# Altium project CoreBoard.PrjPcb
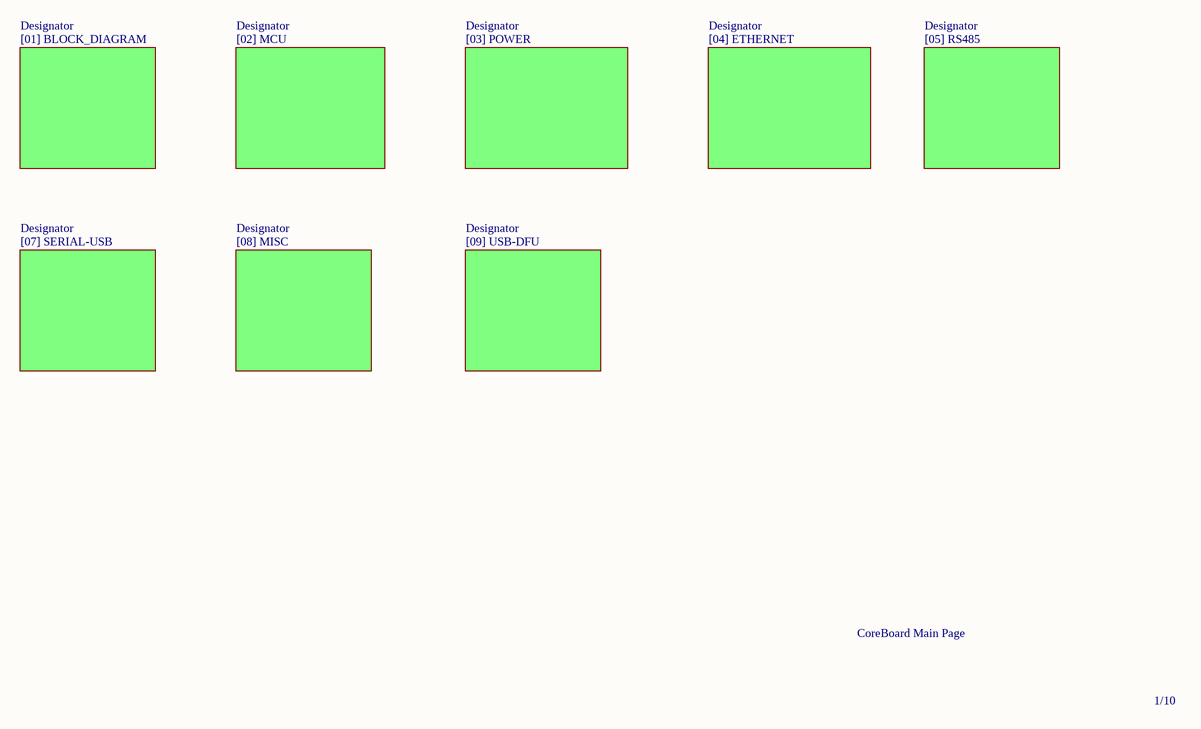
[diagram p0: CoreBoard.SchDoc]
9 sheets, 113 parts. Net scope: flat (ports and power ports of the same name join across sheets).
Board file: PCB.PcbDoc
Sheets:
  CoreBoard.SchDoc
    Designator = [01] BLOCK_DIAGRAM.SchDoc
    Designator = [02] MCU.SchDoc
    Designator = [03] POWER.SchDoc
    Designator = [04] ETHERNET.SchDoc
    Designator = [05] RS485.SchDoc
    Designator = [07] SERIAL-USB.SchDoc
    Designator = [08] MISC.SchDoc
    Designator = [09] USB-DFU.SchDoc

## Sheet CoreBoard.SchDoc: Core Board Simulador E5A/B1
size A4; Date: 01/07/12024; ApprovedBy: Laert Ferreira; Author: Deived Ado/Jonhann Steff.; CompanyName: Metro Rio; Engineer: Jonhann Steffanno; Organization: SENAI; Revision: REV01; SheetNumber: 1; SheetTotal: 10

### Sub-sheets
Designator = [01] BLOCK_DIAGRAM: no entries
Designator = [02] MCU: no entries
Designator = [03] POWER: no entries
Designator = [04] ETHERNET: no entries
Designator = [05] RS485: no entries
Designator = [07] SERIAL-USB: no entries
Designator = [08] MISC: no entries
Designator = [09] USB-DFU: no entries

### Notes on the sheet
- CoreBoard Main Page
- 1/10

## Sheet [01] BLOCK_DIAGRAM.SchDoc
size A4; SheetNumber: 2; SheetTotal: 10
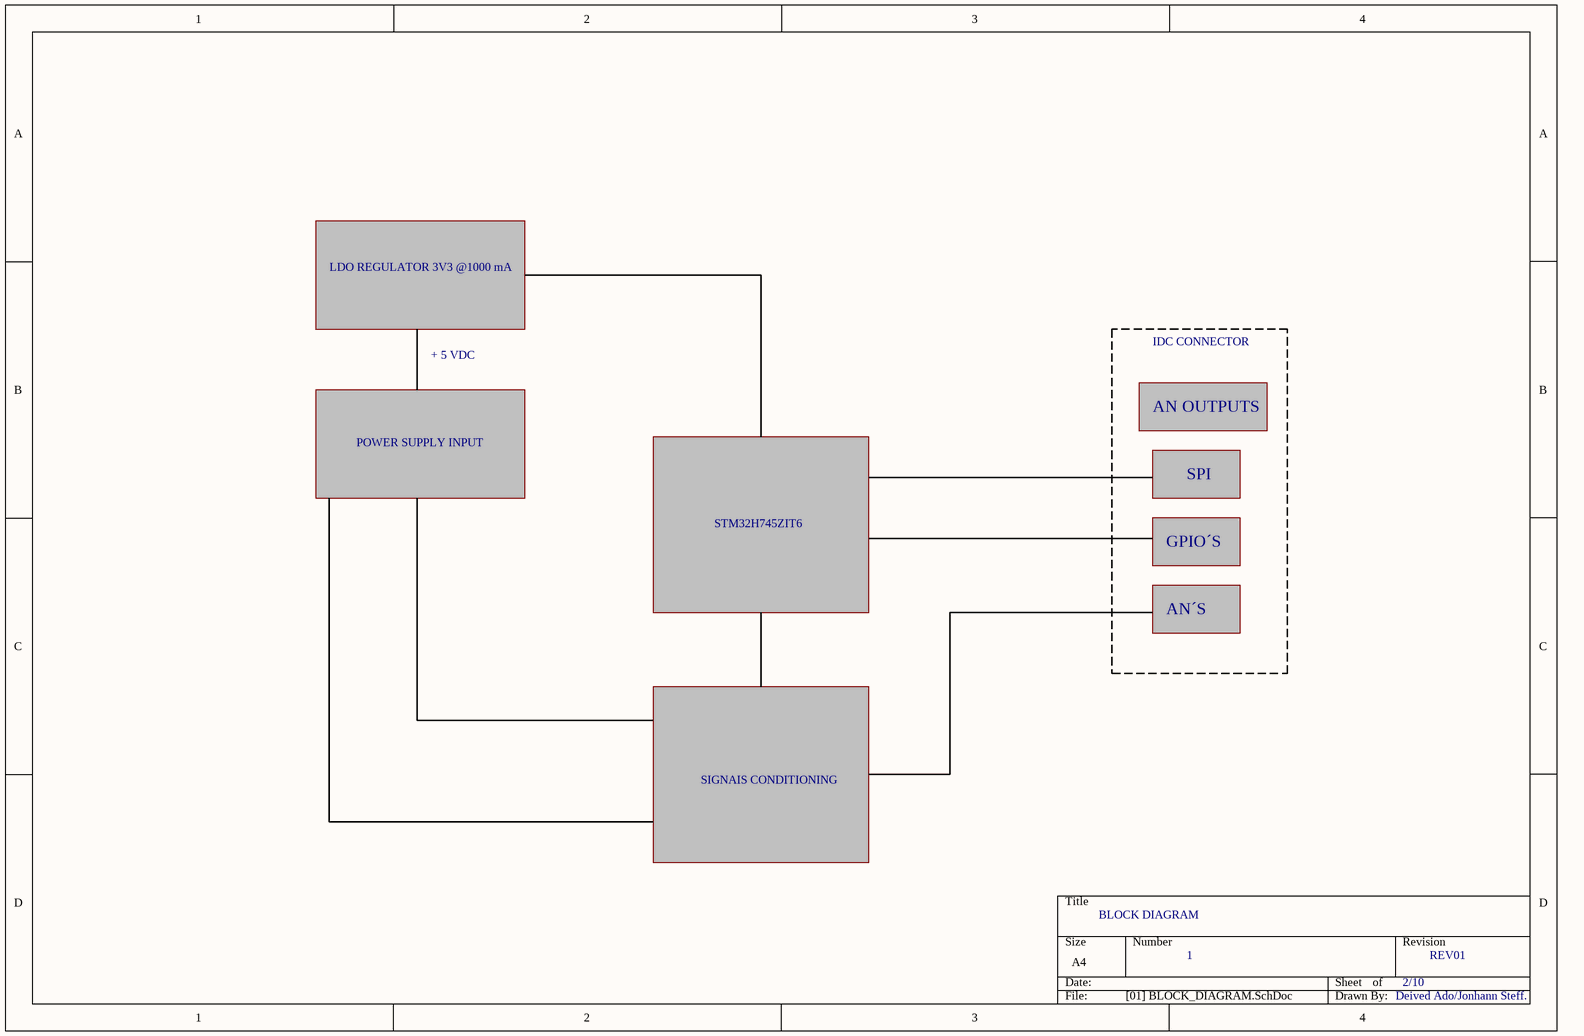
[diagram p1: [01] BLOCK_DIAGRAM.SchDoc]

### Notes on the sheet
- LDO REGULATOR 3V3 @1000 mA
- + 5 VDC
- IDC CONNECTOR
- POWER SUPPLY INPUT
- AN OUTPUTS
- SPI
- STM32H745ZIT6
- GPIO´S
- AN´S
- SIGNAIS CONDITIONING
- BLOCK DIAGRAM
- 1
- 2/10
- REV01
- Deived Ado/Jonhann Steff.

## Sheet [02] MCU.SchDoc
size A4; ApprovedBy: Laert Ferreira; Author: Deived Azevedo; CompanyName: Metro Rio; SheetNumber: 3; CurrentDate: 01/07/2024; ProjectName: CoreBoard
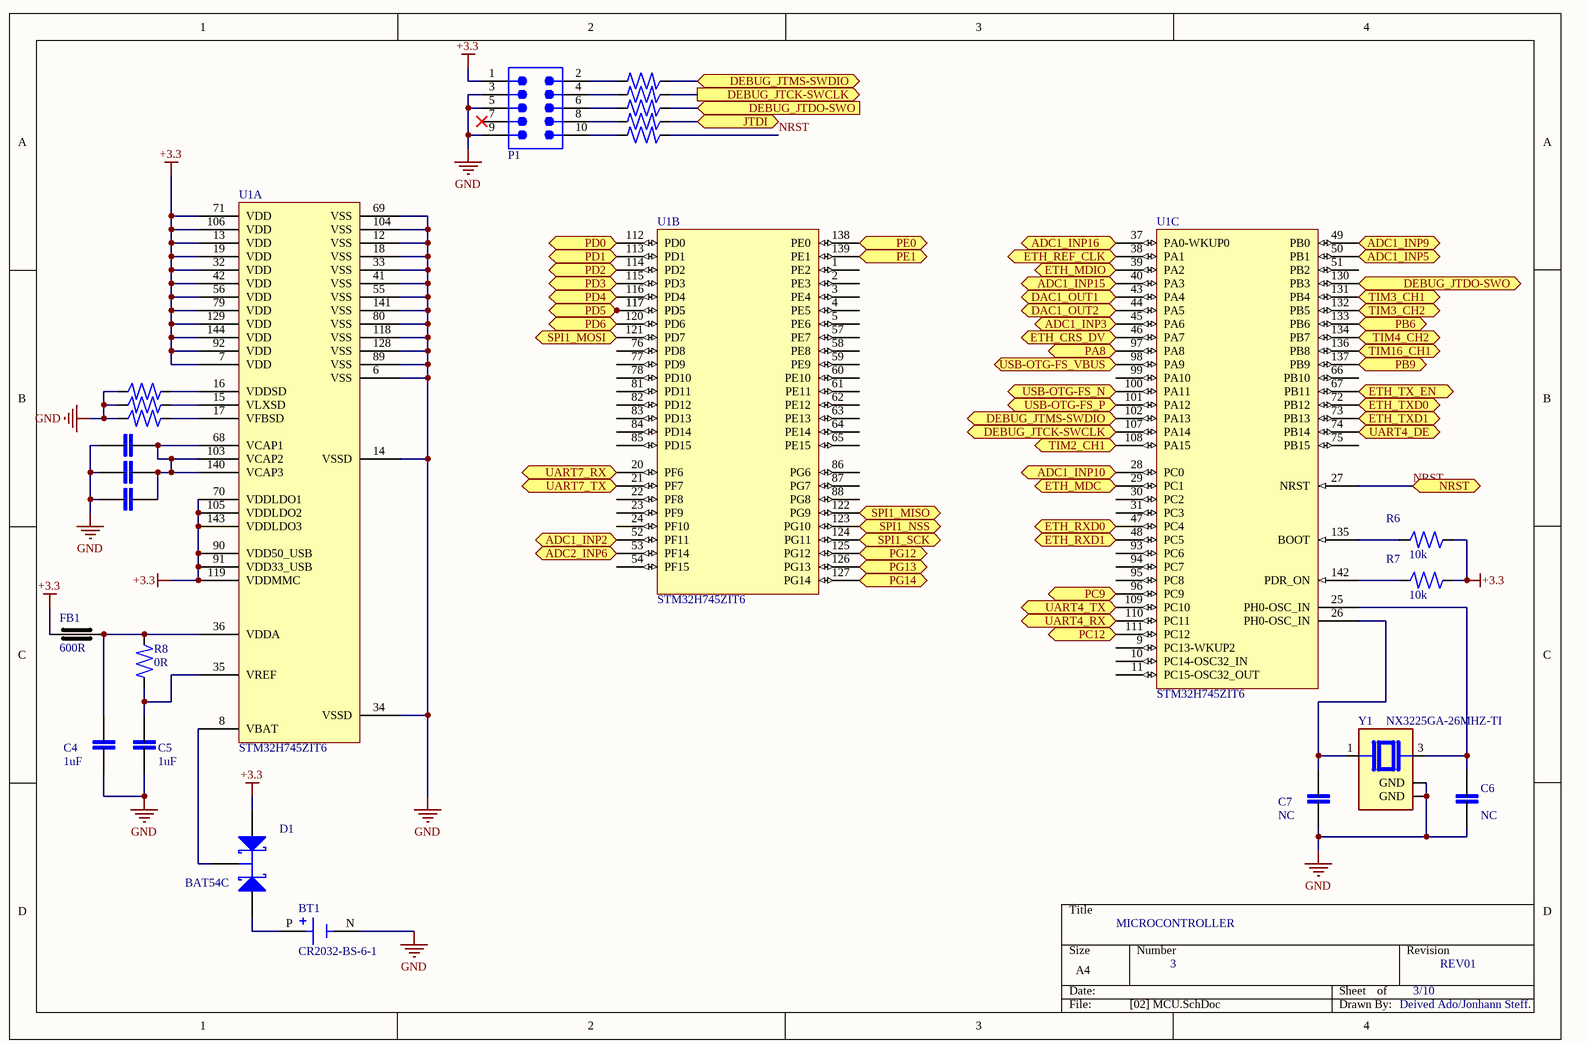
[diagram p2: [02] MCU.SchDoc]

### Parts
BT1  CR2032-BS-6-1  [BAT_CR2032-BS-6-1]
C1  2.2uF  [cap_0603]  (value not drawn)
C2  2.2uF  [cap_0603]  (value not drawn)
C3  2.2uF  [cap_0603]  (value not drawn)
C4  1uF  [cap_0603]
C5  1uF  [cap_0603]
C6  NC  [cap_0603]
C7  NC  [cap_0603]
D1  BAT54C  [SOT23_N]
FB1  600R  [cap_0603]
P1  62701020621  [SAMTEC-FTS-105-03-X-DV]  (value not drawn)
R1  22R  [RES_0603]  (value not drawn)
R2  22R  [RES_0603]  (value not drawn)
R3  22R  [RES_0603]  (value not drawn)
R4  22R  [RES_0603]  (value not drawn)
R5  22R  [RES_0603]  (value not drawn)
R6  10k  [res_0603]
R7  10k  [res_0603]
R8  0R  [res_0603]
R37  0R  [res_0603]  (value not drawn)
R38  0R  [res_0603]  (value not drawn)
R39  0R  [res_0603]  (value not drawn)
U1  STM32H745ZIT6  [LQFP144]  (parts A,B,C of 3)
Y1  NX3225GA-26MHZ-TI  [XTAL_NX3225SA-25.000M-STD-CRS-2]

### Ports
ADC1_INP2 (in), ADC1_INP3, ADC1_INP5 (in), ADC1_INP9 (in), ADC1_INP10 (in), ADC1_INP15, ADC1_INP16, ADC2_INP6 (in), DAC1_OUT1 (out), DAC1_OUT2 (out), DEBUG_JTCK-SWCLK (in), DEBUG_JTCK-SWCLK (out), DEBUG_JTDO-SWO (in), DEBUG_JTDO-SWO (out), DEBUG_JTMS-SWDIO, DEBUG_JTMS-SWDIO (bidir), ETH_CRS_DV, ETH_MDC (out), ETH_MDIO (bidir), ETH_REF_CLK (in), ETH_RXD0 (bidir), ETH_RXD1 (bidir), ETH_TX_EN (out), ETH_TXD0 (out), ETH_TXD1 (out), JTDI, NRST, PA8 (bidir), PB6 (bidir), PB9 (bidir), PC9 (bidir), PC12 (bidir), PD0 (bidir), PD1 (bidir), PD2 (bidir), PD3 (bidir), PD4 (bidir), PD5 (bidir), PD6 (bidir), PE0 (bidir), PE1 (bidir), PG12 (bidir), PG13 (bidir), PG14 (bidir), SPI1_MISO (in), SPI1_MOSI (out), SPI1_NSS (out), SPI1_SCK (out), TIM2_CH1 (out), TIM3_CH1 (out), TIM3_CH2 (out), TIM4_CH2 (out), TIM16_CH1 (out), UART4_DE (out), UART4_RX (in), UART4_TX (out), UART7_RX (in), UART7_TX (out), USB-OTG-FS_N (bidir), USB-OTG-FS_P (bidir), USB-OTG-FS_VBUS

### Nets
+3.3: D1.2(A2) FB1.1 P1.1 R6.1 R7.1 U1.7(VDD) U1.13(VDD) U1.19(VDD) U1.32(VDD) U1.42(VDD) U1.56(VDD) U1.70(VDDLDO1) U1.71(VDD) U1.79(VDD) U1.90(VDD50_USB) U1.91(VDD33_USB) U1.92(VDD) U1.105(VDDLDO2) U1.106(VDD) U1.119(VDDMMC) U1.129(VDD) U1.143(VDDLDO3) U1.144(VDD)
GND: BT1.N(NEG) C1.1 C2.1 C3.1 C4.1 C5.1 C6.1 C7.1 P1.3 P1.5 P1.9 R37.2 R38.2 R39.2 U1.6(VSS) U1.12(VSS) U1.14(VSSD) U1.18(VSS) U1.33(VSS) U1.34(VSSD) U1.41(VSS) U1.55(VSS) U1.69(VSS) U1.80(VSS) U1.89(VSS) U1.104(VSS) U1.118(VSS) U1.128(VSS) U1.141(VSS) Y1.2(GND) Y1.4(GND)
NRST: R5.2 U1.27(NRST) ; port NRST
USB-OTG-FS_N: U1.100(PA11) ; port USB-OTG-FS_N
USB-OTG-FS_P: U1.101(PA12) ; port USB-OTG-FS_P
NetBT1_P: BT1.P(POS) D1.1(A1)
NetC1_2: C1.2 C2.2 C3.2 U1.68(VCAP1) U1.103(VCAP2) U1.140(VCAP3)
NetC4_2: C4.2 FB1.2 R8.2 U1.36(VDDA)
NetC5_2: C5.2 R8.1 U1.35(VREF)
NetC6_2: C6.2 U1.25(PH0-OSC_IN) Y1.3
NetC7_2: C7.2 U1.26(PH0-OSC_IN) Y1.1
NetC24_2: U1.98(PA9) ; port USB-OTG-FS_VBUS
NetD1_3: D1.3(K) U1.8(VBAT)
NetP1_2: P1.2 R1.1
NetP1_4: P1.4 R2.1
NetP1_6: P1.6 R3.1
NetP1_8: P1.8 R4.1
NetP1_10: P1.10 R5.1
NetP2_6: U1.96(PC9) ; port PC9
NetP2_8: U1.97(PA8) ; port PA8
NetP2_10: U1.108(PA15) ; port TIM2_CH1
NetP2_12: U1.111(PC12) ; port PC12
NetP2_14: U1.112(PD0) ; port PD0
NetP2_16: U1.113(PD1) ; port PD1
NetP2_18: U1.114(PD2) ; port PD2
NetP2_20: U1.115(PD3) ; port PD3
NetP2_22: U1.116(PD4) ; port PD4
NetP2_24: U1.117(PD5) ; port PD5
NetP2_26: U1.120(PD6) ; port PD6
NetP2_28: U1.121(PD7) ; port SPI1_MOSI
NetP2_30: U1.122(PG9) ; port SPI1_MISO
NetP2_32: U1.123(PG10) ; port SPI1_NSS
NetP2_34: U1.124(PG11) ; port SPI1_SCK
NetP2_36: U1.125(PG12) ; port PG12
NetP2_38: U1.126(PG13) ; port PG13
NetP2_40: U1.127(PG14) ; port PG14
NetP4_6: U1.131(PB4) ; port TIM3_CH1
NetP4_8: U1.132(PB5) ; port TIM3_CH2
NetP4_10: U1.133(PB6) ; port PB6
NetP4_12: U1.134(PB7) ; port TIM4_CH2
NetP4_14: U1.136(PB8) ; port TIM16_CH1
NetP4_16: U1.137(PB9) ; port PB9
NetP4_18: U1.138(PE0) ; port PE0
NetP4_20: U1.139(PE1) ; port PE1
NetP4_22: U1.53(PF14) ; port ADC2_INP6
NetP4_24: U1.52(PF11) ; port ADC1_INP2
NetP4_26: U1.50(PB1) ; port ADC1_INP5
NetP4_28: U1.49(PB0) ; port ADC1_INP9
NetP4_30: U1.45(PA6) ; port ADC1_INP3
NetP4_32: U1.44(PA5) ; port DAC1_OUT2
NetP4_34: U1.43(PA4) ; port DAC1_OUT1
NetP4_36: U1.40(PA3) ; port ADC1_INP15
NetP4_38: U1.37(PA0-WKUP0) ; port ADC1_INP16
NetP4_40: U1.28(PC0) ; port ADC1_INP10
NetR1_2: R1.2 U1.102(PA13) ; port DEBUG_JTMS-SWDIO
NetR2_2: R2.2 U1.107(PA14) ; port DEBUG_JTCK-SWCLK
NetR3_2: R3.2 U1.130(PB3) ; port DEBUG_JTDO-SWO
NetR4_2: R4.2 ; port JTDI
NetR6_2: R6.2 U1.135(BOOT)
NetR7_2: R7.2 U1.142(PDR_ON)
NetR12_2: U1.39(PA2) ; port ETH_MDIO
NetR20_1: U1.38(PA1) ; port ETH_REF_CLK
NetR22_2: U1.47(PC4) ; port ETH_RXD0
NetR23_2: U1.48(PC5) ; port ETH_RXD1
NetR24_2: U1.46(PA7) ; port ETH_CRS_DV
NetR37_1: R37.1 U1.16(VDDSD)
NetR38_1: R38.1 U1.15(VLXSD)
NetR39_1: R39.1 U1.17(VFBSD)
NetU1_20: U1.20(PF6) ; port UART7_RX
NetU1_21: U1.21(PF7) ; port UART7_TX
NetU1_29: U1.29(PC1) ; port ETH_MDC
NetU1_67: U1.67(PB11) ; port ETH_TX_EN
NetU1_72: U1.72(PB12) ; port ETH_TXD0
NetU1_73: U1.73(PB13) ; port ETH_TXD1
NetU1_74: U1.74(PB14) ; port UART4_DE
NetU1_109: U1.109(PC10) ; port UART4_TX
NetU1_110: U1.110(PC11) ; port UART4_RX

Not connected (* = marked no-connect by the designer): P1 7*; U1 1(PE2) 2(PE3) 3(PE4) 4(PE5) 5(PE6) 9(PC13-WKUP2) 10(PC14-OSC32_IN) 11(PC15-OSC32_OUT) 22(PF8) 23(PF9) 24(PF10) 30(PC2) 31(PC3) 51(PB2) 54(PF15) 57(PE7) 58(PE8) 59(PE9) 60(PE10) 61(PE11) 62(PE12) 63(PE13) 64(PE14) 65(PE15) 66(PB10) 75(PB15) 76(PD8) 77(PD9) 78(PD10) 81(PD11) 82(PD12) 83(PD13) 84(PD14) 85(PD15) 86(PG6) 87(PG7) 88(PG8) 93(PC6) 94(PC7) 95(PC8) 99(PA10)

### Notes on the sheet
- MICROCONTROLLER
- 3
- 3/10
- REV01
- Deived Ado/Jonhann Steff.

### Library data of the parts
BT1 = CR2032-BS-6-1: Battery base CR2032 SMD Battery Connectors ROHS; MF: Shenzhen Q&J Electronics Co. Ltd; Package: Package; Check_prices: https://www.snapeda.com/parts/CR2032-BS-6-1/Shenzhen+Q%2526J+Electronics+Co.+Ltd/view-part/?ref=eda; SnapEDA_Link: https://www.snapeda.com/parts/CR2032-BS-6-1/Shenzhen+Q%2526J+Electronics+Co.+Ltd/view-part/?ref=snap; MP: CR2032-BS-6-1; Value: *; Availability: Not in stock; Price: None
C1-C7 = C_Small: Generic capacitor symbol
D1 = BAT54C: Schottky Barrier Double Diode; Published: 17-Sep-2003; LatestRevisionDate: 12-Dec-2006; LatestRevisionNote: IPC-7351 Footprint Added.; DatasheetVersion: 4-Mar-2002; PackageVersion: May-1999; PackageReference: SOT23; Publisher: Altium Limited; PackageDescription: 3-Pin SOT-23 Package 0.95 mm Pitch, 2.3 mm Lead Span; ComponentLink1Description: Manufacturer Link; ComponentLink1URL: http://www.semiconductors.philips.com/; ComponentLink2Description: Datasheet; ComponentLink2URL: http://www.semiconductors.philips.com/acrobat/datasheets/BAT54_SERIES_4.pdf
FB1 = FerriteBead_Small
P1 = 62701020621: WR-BHD Male Box Header, SMT Straight, pitch 1.27mm, 2 row, 10 pin; Manufacturer: Wurth Elektronik; Contact Resistance: 20mOhm; Insulation Resistance: 1000MOhm; Rated Current: 1A; Working Voltage: 50V; Withstanding Voltage: 500V; Manufacturer Part Number: 62701020621; Category: Wire-to-Board Connectors; Match Code: WR-BHD; ComponentLink1Description: Website Link; ComponentLink1URL: https://www.we-online.com/redexpert/article/62701020621?ad; ComponentLink2Description: Datasheet Link; ComponentLink2URL: https://www.we-online.com/redexpert/spec/62701020621?ad; Mount: Surface Mount; Operating Temperature Max: 105°C; Operating Temperature Min: -40°C; Packaging: Tape and Reel; Length: 12.7mm; Width: 5mm; Height: 5.3mm; Gender: Male; Number of Pins: 10; Number of Rows: 2; Orientation: Straight; Pitch: 1.27mm
R1-R8 R37-R39 = R_Small: Generic Resistor symbol
U1 = STM32H745ZIT6: High-performance and DSP with DP-FPU, Dual core Arm Cortex-M7+ Cortex-M4 MCU with 2MBytes of Flash memory, 1MB RAM, 480 MHz CPU, Art Accelerator, L1 cache, external memory interface, large set of peripherals, SMPS
Y1 = NX3225GA-26MHZ-TI: 26 MHz Â±20ppm Crystal 10pF 50 Ohms 4-SMD, No Lead; MF: NDK America,; SnapEDA_Link: https://www.snapeda.com/parts/NX3225GA-26MHZ-TI/NDK+America%252C+Inc./view-part/?ref=snap; Price: None; Purchase-URL: https://pricing.snapeda.com/search/part/NX3225GA-26MHZ-TI/?ref=eda; Value: *; MP: NX3225GA-26MHZ-TI; Availability: In Stock; Check_prices: https://www.snapeda.com/parts/NX3225GA-26MHZ-TI/NDK+America%252C+Inc./view-part/?ref=eda; Package: SMD-4 NDK

## Sheet [03] POWER.SchDoc
size A4; SheetNumber: 4
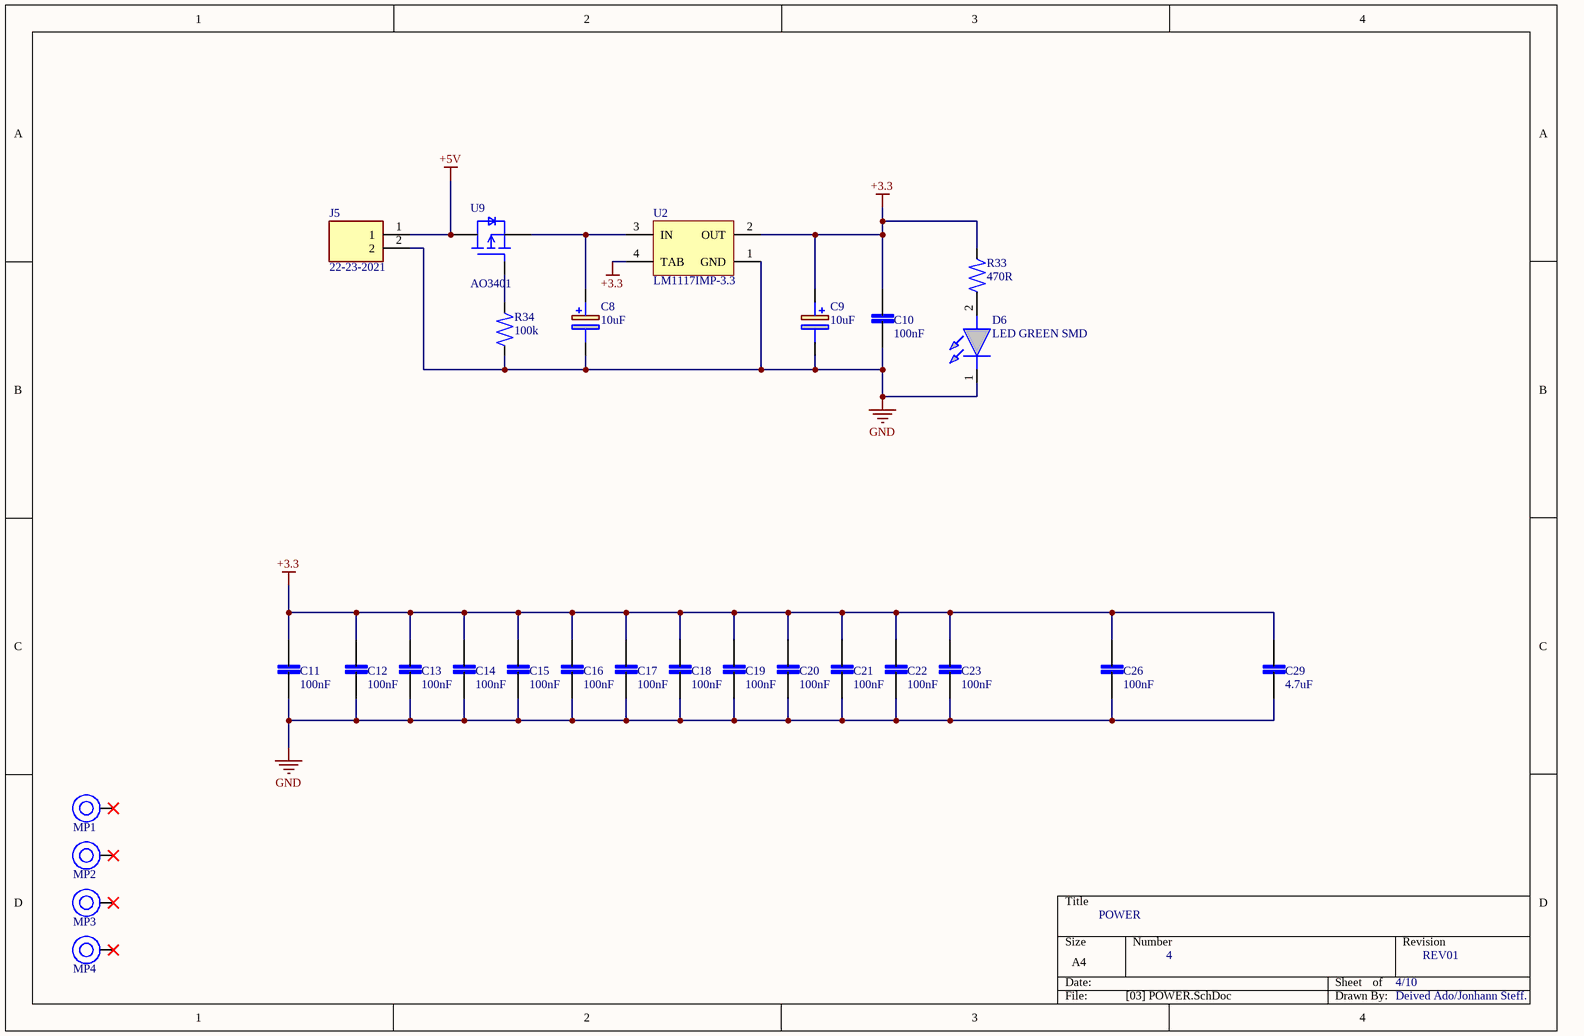
[diagram p3: [03] POWER.SchDoc]

### Parts
C8  10uF  [CAP_E_830X650N]
C9  10uF  [CAP_E_830X650N]
C10  100nF  [cap_0603]
C11  100nF  [cap_0603]
C12  100nF  [cap_0603]
C13  100nF  [cap_0603]
C14  100nF  [cap_0603]
C15  100nF  [cap_0603]
C16  100nF  [cap_0603]
C17  100nF  [cap_0603]
C18  100nF  [cap_0603]
C19  100nF  [cap_0603]
C20  100nF  [cap_0603]
C21  100nF  [cap_0603]
C22  100nF  [cap_0603]
C23  100nF  [cap_0603]
C26  100nF  [cap_0603]
C29  4.7uF  [cap_0603]
D6  LED GREEN SMD  [LED 0805]
J5  22-23-2021  [SHDR2W87P0X254_1X2_493X635X1105P]
MP1  M3 x 5mm  [78614050360]  (value not drawn)
MP2  M3 x 5mm  [78614050360]  (value not drawn)
MP3  M3 x 5mm  [78614050360]  (value not drawn)
MP4  M3 x 5mm  [78614050360]  (value not drawn)
R33  470R  [RES_0603]
R34  100k  [RES_0603]
U2  LM1117IMP-3.3  [MP04A_N]
U9  AO3401  [SOT23-3]

### Nets
+3.3: C9.1(+) C10.2 C11.2 C12.2 C13.2 C14.2 C15.2 C16.2 C17.2 C18.2 C19.2 C20.2 C21.2 C22.2 C23.2 C26.2 C29.2 R33.2 U2.2(OUT) U2.4(TAB)
+5V: J5.1 U9.3(D)
GND: C8.2(-) C9.2(-) C10.1 C11.1 C12.1 C13.1 C14.1 C15.1 C16.1 C17.1 C18.1 C19.1 C20.1 C21.1 C22.1 C23.1 C26.1 C29.1 D6.1(K) J5.2 R34.1 U2.1(GND)
NetC8_1: C8.1(+) U2.3(IN) U9.2(S)
NetD6_2: D6.2(A) R33.1
NetR34_2: R34.2 U9.1(G)

Not connected (* = marked no-connect by the designer): MP1 1*; MP2 1*; MP3 1*; MP4 1*

### Notes on the sheet
- POWER
- 4
- 4/10
- REV01
- Deived Ado/Jonhann Steff.

### Library data of the parts
C8 C9 = C_CP
C10-C23 C26 C29 = C_Small: Generic capacitor symbol
D6 = LED GREEN SMD: LED Green 0805 Rectangular; Mfr. Part #: 15008GS75000; Manufacturer: Wurth Elektronik; Purchase-URL: https://br.mouser.com/ProductDetail/Wurth-Elektronik/150080GS75000?qs=2kOmHSv6VfQRoTEZVk1mGA%3D%3D; Datasheet: https://www.we-online.com/components/products/datasheet/150080GS75000.pdf; Price: 0,19
J5 = KK - HDR 2P: Headers & Wire Housings VERT PCB HDR 2P TIN FRICTION LOCK; Manufacturer: Molex; Price: 0,21; Purchase-URL: https://br.mouser.com/ProductDetail/Molex/22-23-2021?qs=ILqg114nvd4YKlRlbo3yMg%3D%3D; Mfr. Part #: 22-23-2021; Datasheet: https://tools.molex.com/pdm_docs/sd/022232021_sd.pdf
MP1-MP4 = 78614050360: WA-SMSA SMT Spacer Studs Automotive, OD 6mm, ID 4.2mm, M3 x 5mm; Manufacturer: Wurth Elektronik; Surface: Tin; Solder Cream Thickness Min: 150um; Tightenning Torque Max: 0.5N*m; Manufacturer Part Number: 78614050360; Category: SMT Spacers; Match Code: WA-SMSA; ComponentLink1Description: Website Link; ComponentLink1URL: https://www.we-online.com/redexpert/article/78614050360?ad; ComponentLink2Description: Datasheet Link; ComponentLink2URL: https://www.we-online.com/redexpert/spec/78614050360?ad; Mount: Surface Mount; Operating Temperature Max: 150°C; Operating Temperature Min: -55°C; Packaging: Tape and Reel; Height: 5mm; Automotive: Yes; Inside Diameter: 4.2mm; Material: Steel; Outside Diameter: 6mm; Thread Size: M3
R33 R34 = R_Small: Generic Resistor symbol
U2 = LM1117IMP-3.3: 800mA Low-Dropout Linear Regulator, 4-pin SOT-223; Manufacturer: National Semiconductor; PackageTopMarking: XYTT*N05B; PowerWise: N; CompType: LDO IC; Published: 4-Dec-2008; DatasheetVersion: Apr-2006; PackageVersion: revB, Apr-2003; PackageReference: MP04A; Publisher: Altium Limited; PackageDescription: Molded SOT-223, 6.50 x 3.56 x 1.6mm Body, 4 Lead, 2.3mm Pitch; Supplier 1: Farnell; Supplier Part Number 1: 7614123; PartNumber: LM1117IMP-3.3; RoHS: N; PinCount: 4; Code_JEDEC: TO-261-AA; Code_IPC: SOT223-4; ComponentLink1Description: LM1117 Datasheet; ComponentLink1URL: http://www.national.com/ds/LM/LM1117.pdf; ComponentLink2Description: LM1117 Web Page; ComponentLink2URL: http://www.national.com/pf/LM/LM1117.html; ComponentLink3Description: MP04A Package Page; ComponentLink3URL: http://www.national.com/packaging/folders/mp04a.html
U9 = AO3401: P-Channel 30 V 4A (Ta) 1.4W (Ta) Surface Mount SOT-23-3; MF: Alpha &; SnapEDA_Link: https://www.snapeda.com/parts/AO3401/Alpha+%2526+Omega+Semiconductor+Inc./view-part/?ref=snap; Package: TO-236-3 Alpha &amp; Omega Semiconductor Inc.; Value: *; MP: AO3401; Check_prices: https://www.snapeda.com/parts/AO3401/Alpha+%2526+Omega+Semiconductor+Inc./view-part/?ref=eda

## Sheet [04] ETHERNET.SchDoc
size A3; SheetNumber: 5
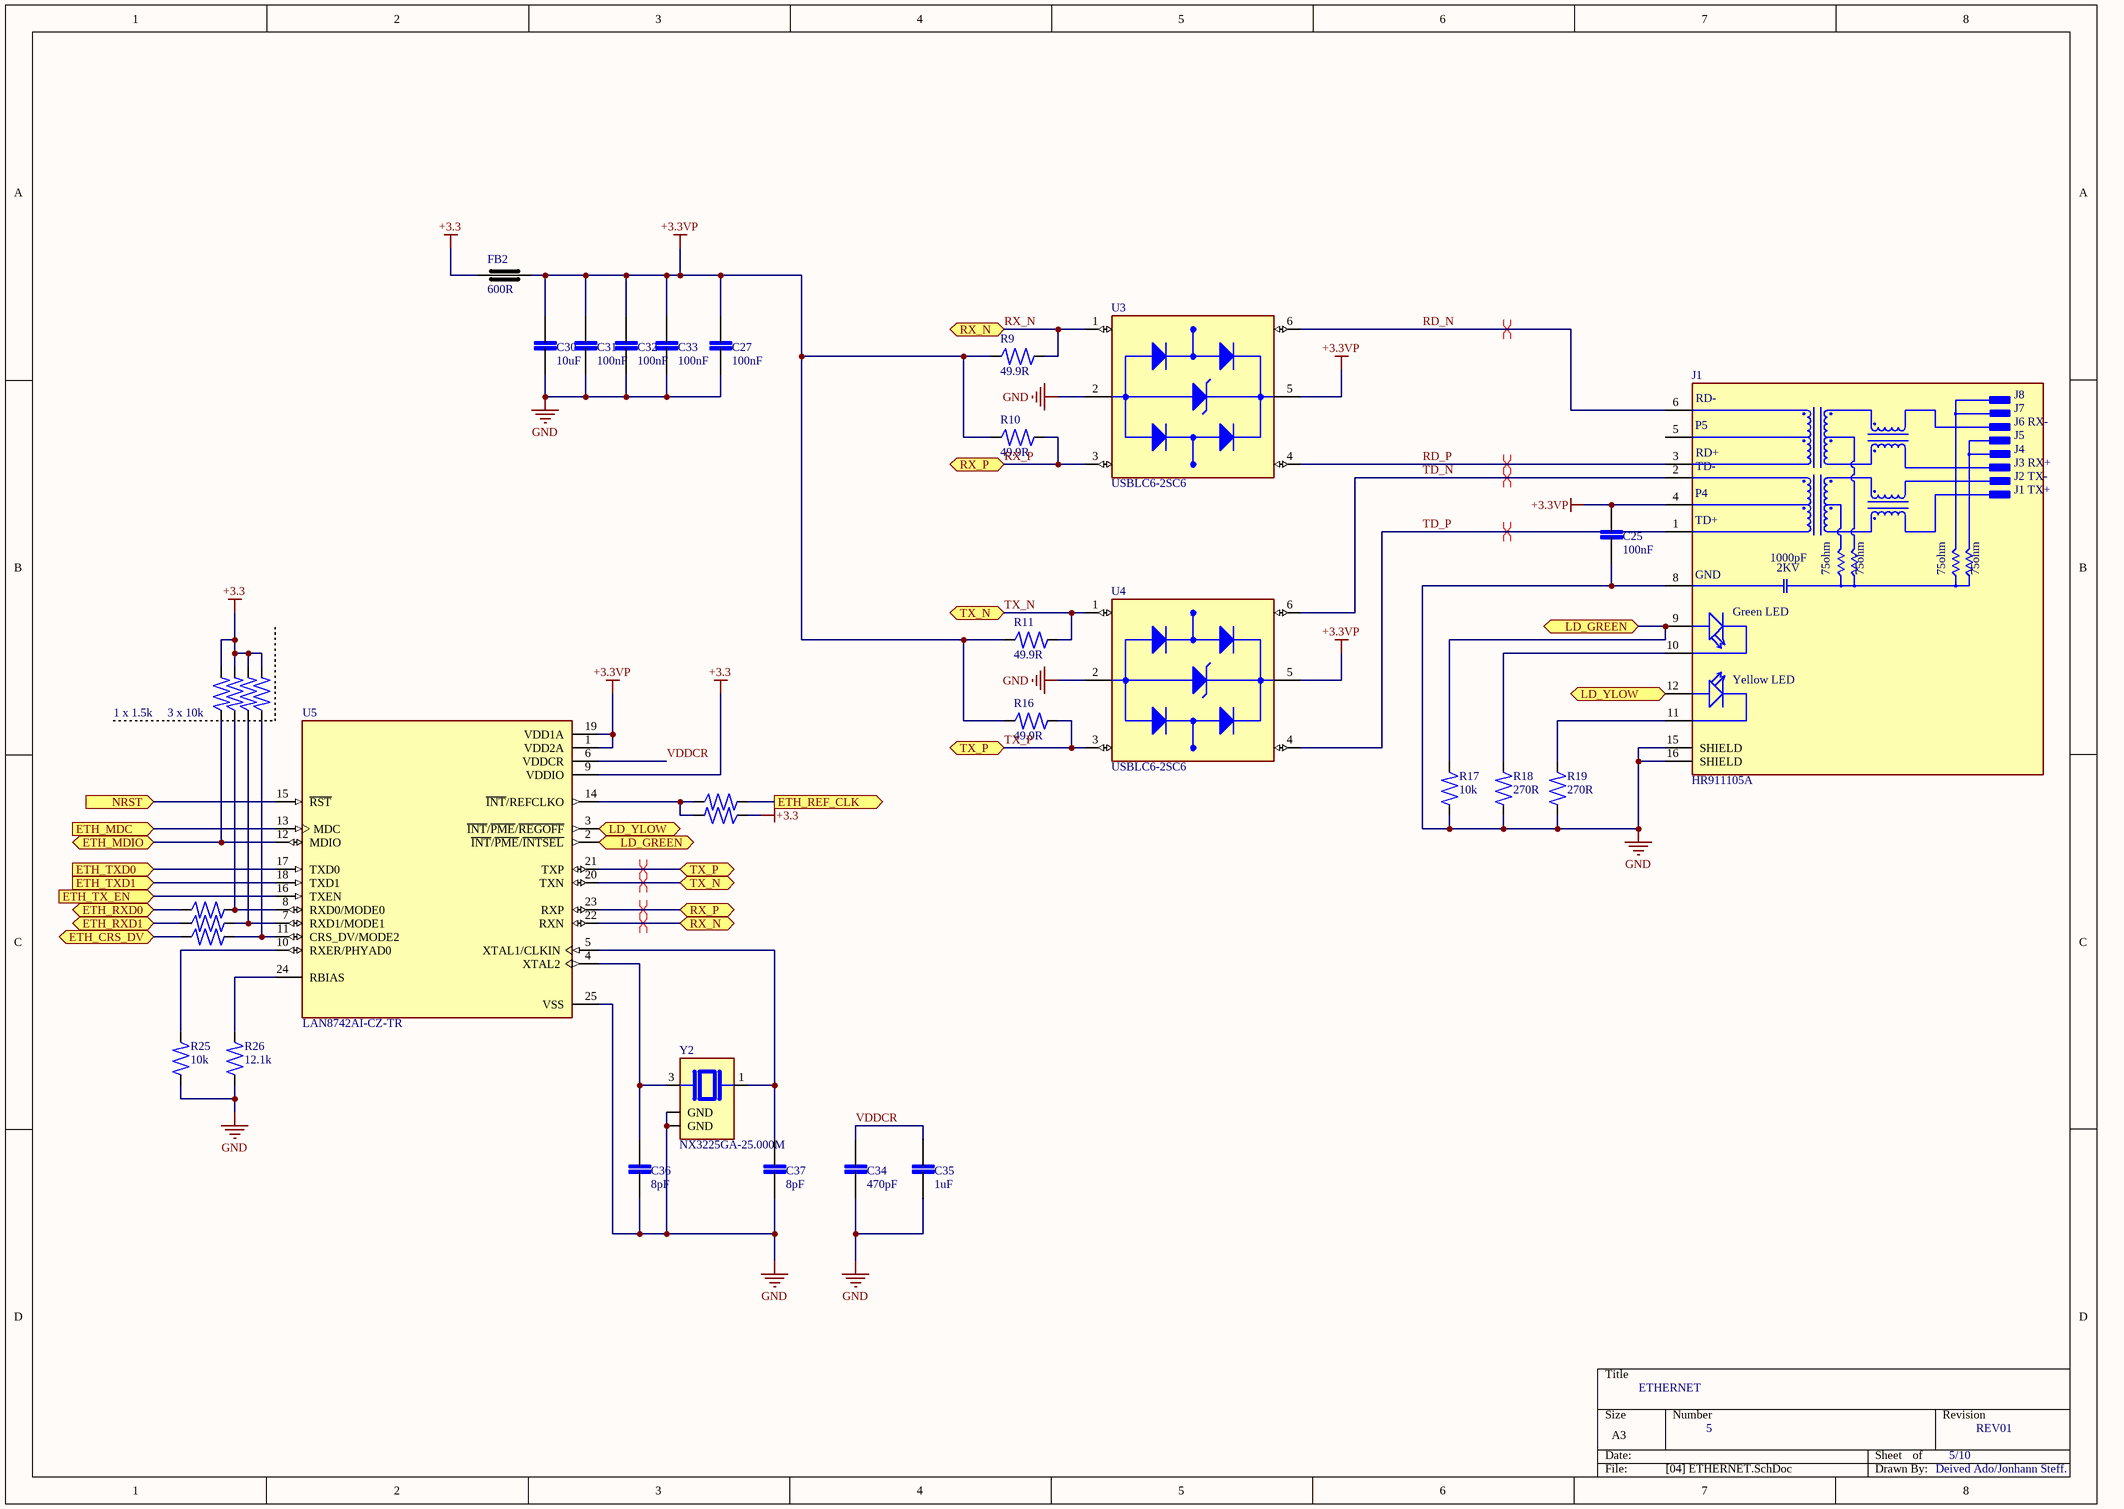
[diagram p4: [04] ETHERNET.SchDoc]

### Parts
C25  100nF  [cap_0603]
C27  100nF  [cap_0603]
C30  10uF  [cap_0603]
C31  100nF  [cap_0603]
C32  100nF  [cap_0603]
C33  100nF  [cap_0603]
C34  470pF  [cap_0603]
C35  1uF  [cap_0603]
C36  8pF  [cap_0603]
C37  8pF  [cap_0603]
FB2  600R  [res_0603]
J1  HR911105A  [HANRUN_HR911105A]
R9  49.9R  [res_0603]
R10  49.9R  [res_0603]
R11  49.9R  [res_0603]
R12  10k  [res_0603]  (value not drawn)
R13  10k  [res_0603]  (value not drawn)
R14  10k  [res_0603]  (value not drawn)
R15  10k  [res_0603]  (value not drawn)
R16  49.9R  [res_0603]
R17  10k  [res_0603]
R18  270R  [res_0603]
R19  270R  [res_0603]
R20  33R  [res_0603]  (value not drawn)
R21  10k  [res_0603]  (value not drawn)
R22  33R  [res_0603]  (value not drawn)
R23  33R  [RES_0603]  (value not drawn)
R24  33R  [res_0603]  (value not drawn)
R25  10k  [res_0603]
R26  12.1k  [res_0603]
U3  USBLC6-2SC6  [SOT95P280X145-6N]
U4  USBLC6-2SC6  [SOT95P280X145-6N]
U5  LAN8742AI-CZ-TR  [QFN50P400X400X100-25N]
Y2  NX3225GA-25.000M  [XTAL_NX3225SA-25.000M-STD-CRS-2]

### Ports
ETH_CRS_DV, ETH_MDC (in), ETH_MDIO (bidir), ETH_REF_CLK (out), ETH_RXD0 (bidir), ETH_RXD1 (bidir), ETH_TX_EN (in), ETH_TXD0 (in), ETH_TXD1 (in), LD_GREEN, LD_GREEN (out), LD_YLOW, LD_YLOW (out), NRST (in), RX_N, RX_P, TX_N (bidir), TX_P (bidir)

### Nets
+3.3: FB2.1 R12.1 R13.1 R14.1 R15.1 R21.2 U5.9(VDDIO)
+3.3VP: C25.1 C27.1 C30.1 C31.1 C32.1 C33.1 FB2.2 J1.4(P4) R9.2 R10.2 R11.2 R16.2 U3.5(VBUS) U4.5(VBUS) U5.1(VDD2A) U5.19(VDD1A)
GND: C25.2 C27.2 C30.2 C31.2 C32.2 C33.2 C34.2 C35.2 C36.1 C37.1 J1.8(GND) J1.15(SHIELD) J1.16(SHIELD) R17.1 R18.1 R19.1 R25.1 R26.1 U3.2(GND) U4.2(GND) U5.25(VSS) Y2.2(GND) Y2.4(GND)
NRST: U5.15(~{RST}) ; port NRST
RD_N: J1.6(RD-) U3.6(I/O1_OUT)
RD_P: J1.3(RD+) U3.4(I/O2_OUT)
RX_N: R9.1 U3.1(I/O1_IN) U5.22(RXN) ; port RX_N
RX_P: R10.1 U3.3(I/O2_IN) U5.23(RXP) ; port RX_P
TD_N: J1.2(TD-) U4.6(I/O1_OUT)
TD_P: J1.1(TD+) U4.4(I/O2_OUT)
TX_N: R11.1 U4.1(I/O1_IN) U5.20(TXN) ; port TX_N
TX_P: R16.1 U4.3(I/O2_IN) U5.21(TXP) ; port TX_P
VDDCR: C34.1 C35.1 U5.6(VDDCR)
NetC36_2: C36.2 U5.4(XTAL2) Y2.3
NetC37_2: C37.2 U5.5(XTAL1/CLKIN) Y2.1
NetJ1_9: J1.9(GA) R17.2 U5.2(~{INT}/~{PME}/~{INTSEL}) ; port LD_GREEN
NetJ1_10: J1.10(GC) R18.2
NetJ1_11: J1.11(YC) R19.2
NetJ1_12: J1.12(YA) U5.3(~{INT}/~{PME}/~{REGOFF}) ; port LD_YLOW
NetR12_2: R12.2 U5.12(MDIO) ; port ETH_MDIO
NetR13_2: R13.2 R22.1 U5.8(RXD0/MODE0)
NetR14_2: R14.2 R23.1 U5.7(RXD1/MODE1)
NetR15_2: R15.2 R24.1 U5.11(CRS_DV/MODE2)
NetR20_1: R20.1 ; port ETH_REF_CLK
NetR20_2: R20.2 R21.1 U5.14(~{INT}/REFCLKO)
NetR22_2: R22.2 ; port ETH_RXD0
NetR23_2: R23.2 ; port ETH_RXD1
NetR24_2: R24.2 ; port ETH_CRS_DV
NetR25_2: R25.2 U5.10(RXER/PHYAD0)
NetR26_2: R26.2 U5.24(RBIAS)
NetU1_29: U5.13(MDC) ; port ETH_MDC
NetU1_67: U5.16(TXEN) ; port ETH_TX_EN
NetU1_72: U5.17(TXD0) ; port ETH_TXD0
NetU1_73: U5.18(TXD1) ; port ETH_TXD1

Not connected (* = marked no-connect by the designer): J1 5(P5)

### Layout directives
differential pair: RD_N, RD_P, RX_N, RX_P, TD_N, TD_P, TX_N, TX_P

### Notes on the sheet
- 1 x 1.5k
- (near R12) 3 x 10k
- ETHERNET
- 5
- 5/10
- REV01
- Deived Ado/Jonhann Steff.
- (in symbol HR911105A) J8; J7; J6 RX-; J5; J4; J3 RX+; J2 TX-; J1 TX+; 1000pF; 2KV; 75ohm; Green LED; Yellow LED

### Library data of the parts
C25 C27 C30-C35 = C_Small: Generic capacitor symbol
C36 C37 = C_Small: Generic capacitor symbol; PN: 06035A8R0JAT2A
FB2 = FerriteBead_Small
J1 = HR911105A: DIP RJ45 Connector;; MF: hanrun; SnapEDA_Link: https://www.snapeda.com/parts/HR911105A/HanRun/view-part/?ref=snap; Package: None; MP: HR911105A; Check_prices: https://www.snapeda.com/parts/HR911105A/HanRun/view-part/?ref=eda; Price: None; Value: *; Availability: Not in stock
R9-R21 R25 = R_Small: Generic Resistor symbol
R22-R24 = R_Small: Resistores de Filme Espesso - SMD D11/CRCW0603 100 33R 1% ET6 e3; PN: CRCW060333R0FKEC
R26 = R_Small: Resistores de Filme Espesso - SMD 0603 Anti-Surge Res. 0.1%, 12.1Koh; PN: ERJ-PB3B1212V
U3 U4 = USBLC6-2SC6: 17V Clamp 5A (8/20Âµs) Ipp Tvs Diode Surface Mount SOT-23-6; MF: STMicroelectronics; Value: *; SnapEDA_Link: https://www.snapeda.com/parts/USBLC6-2SC6/STMicroelectronics/view-part/?ref=snap; Check_prices: https://www.snapeda.com/parts/USBLC6-2SC6/STMicroelectronics/view-part/?ref=eda; Purchase-URL: https://pricing.snapeda.com/search/part/USBLC6-2SC6/?ref=eda; Price: None; Availability: In Stock; Package: SOT-23-6 STMicroelectronics; MP: USBLC6-2SC6
U5 = LAN8742AI-CZ-TR: 1/1 Transceiver Full Ethernet 24-SQFN (4x4); MF: Microchip; MP: LAN8742AI-CZ-TR; SnapEDA_Link: https://www.snapeda.com/parts/LAN8742AI-CZ-TR/Microchip/view-part/?ref=snap; Availability: In Stock; Package: VFQFN-24 Microchip Technology; Purchase-URL: https://pricing.snapeda.com/search/part/LAN8742AI-CZ-TR/?ref=eda; Check_prices: https://www.snapeda.com/parts/LAN8742AI-CZ-TR/Microchip/view-part/?ref=eda; Value: *; Price: None
Y2 = NX3225GA: Â±20ppm Crystal 10pF 50 Ohms 4-SMD, No Lead; MP: NX3225GA-26MHZ-TI; MF: NDK America,; SnapEDA_Link: https://www.snapeda.com/parts/NX3225GA-26MHZ-TI/NDK+America%252C+Inc./view-part/?ref=snap; Price: None; Purchase-URL: https://pricing.snapeda.com/search/part/NX3225GA-26MHZ-TI/?ref=eda; Value: *; Availability: In Stock; Check_prices: https://www.snapeda.com/parts/NX3225GA-26MHZ-TI/NDK+America%252C+Inc./view-part/?ref=eda; Package: SMD-4 NDK

## Sheet [05] RS485.SchDoc
size A; SheetNumber: 6
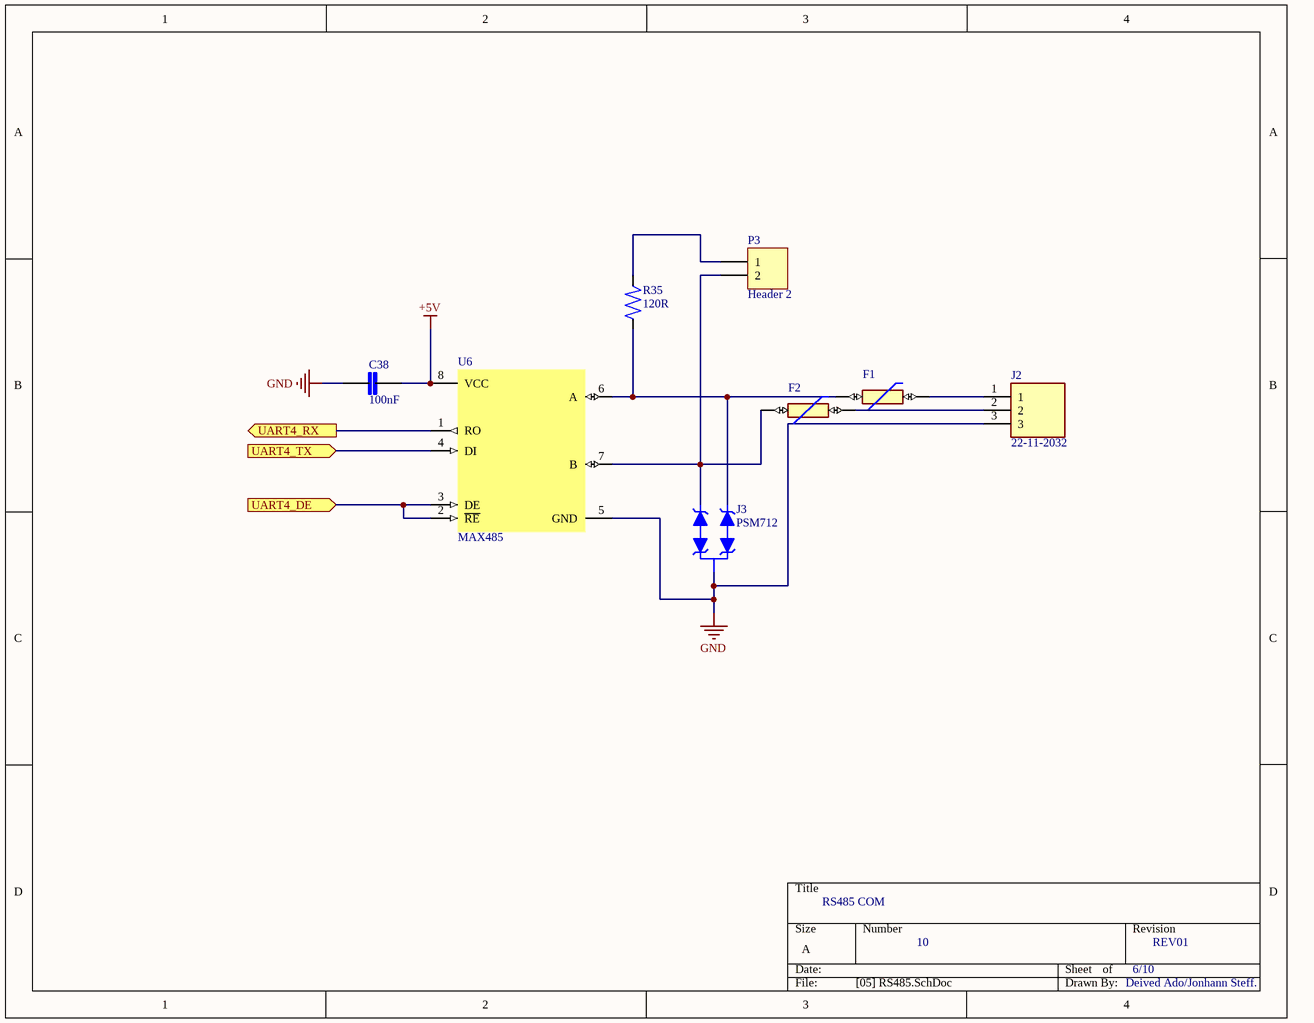
[diagram p5: [05] RS485.SchDoc]

### Parts
C38  100nF  [CAP_0603]
F1  1206L050/15  [RES_1206]  (value not drawn)
F2  1206L050/15  [res_1206]  (value not drawn)
J2  22-11-2032  [HDRV3W87P0X254_1X3_747X635X1105P]
J3  PSM712  [sot-23-3]
P3  Header 2  [HDR1X2]
R35  120R  [RES_0603]
U6  MAX485  [SOIC-8]

### Ports
UART4_DE (in), UART4_RX (out), UART4_TX (in)

### Nets
+5V: C38.2 U6.8(VCC)
GND: C38.1 J2.3 J3.3(C) U6.5(GND)
NetF1_1: F1.1 J3.1(A) R35.1 U6.6(A)
NetF1_2: F1.2 J2.1
NetF2_1: F2.1 J3.2(A1) P3.2 U6.7(B)
NetF2_2: F2.2 J2.2
NetP3_1: P3.1 R35.2
NetU1_74: U6.2(~{RE}) U6.3(DE) ; port UART4_DE
NetU1_109: U6.4(DI) ; port UART4_TX
NetU1_110: U6.1(RO) ; port UART4_RX

### Notes on the sheet
- RS485 COM
- 10
- 6/10
- REV01
- Deived Ado/Jonhann Steff.

### Library data of the parts
C38 = C_Small: Generic capacitor symbol
F1 F2 = 1206L050/15: Polymeric PTC Resettable Fuse 15V 500mA Ih Surface Mount 1206 (3216 Metric), Concave; MF: Littelfuse; Package: None; MP: 1206L050/15; Value: *; Availability: Unavailable; SnapEDA_Link: https://www.snapeda.com/parts/1206L050/15/Littelfuse/view-part/4874799/?ref=snap; Check_prices: https://www.snapeda.com/parts/1206L050/15/Littelfuse/view-part/4874799/?ref=eda; Price: None
J2 = KK - HDR 3P: Molex KK 254 6373, 2.54mm Pitch, 3 Way, 1 Row, Straight PCB Header, Through Hole; Price: 0,63; Purchase-URL: https://www.mouser.co.uk/ProductDetail/Molex/22-11-2032?qs=KHty%2FoMxDPke3knj%252BlB5Gw%3D%3D; Manufacturer: Molex; Mfr. Part #: 22-11-2032; Datasheet: https://tools.molex.com/pdm_docs/sd/022112032_sd.pdf
J3 = PSM712: ESD Suppressor Diode TVS Bi-Dir 12V/7V 3-Pin SOT-23; MF: Texas Instruments; SnapEDA_Link: https://www.snapeda.com/parts/PSM712/Texas+Instruments/view-part/?ref=snap; Package: None; Value: *; MP: PSM712; Check_prices: https://www.snapeda.com/parts/PSM712/Texas+Instruments/view-part/?ref=eda
P3 = Header 2: Header, 2-Pin; LatestRevisionDate: 17-Jul-2002; LatestRevisionNote: Re-released for DXP Platform.; Publisher: Altium Limited
R35 = R_Small: Generic Resistor symbol
U6 = MAX485: Transceiver Half RS422, RS485 8-SOIC; Mfr. Part #: MAX485ESA+; Manufacturer: Analog Devices / Maxim Integrated; Purchase-URL: https://br.mouser.com/ProductDetail/Analog-Devices-Maxim-Integrated/MAX485ESA%2b?qs=1THa7WoU59HHuBnHtoz5mw%3D%3D; Package: SOIC-8 Maxim; Price: 5,27; Datasheet: https://br.mouser.com/datasheet/2/609/MAX1487_MAX491-3129519.pdf

## Sheet [07] SERIAL-USB.SchDoc
size A4; SheetNumber: 7
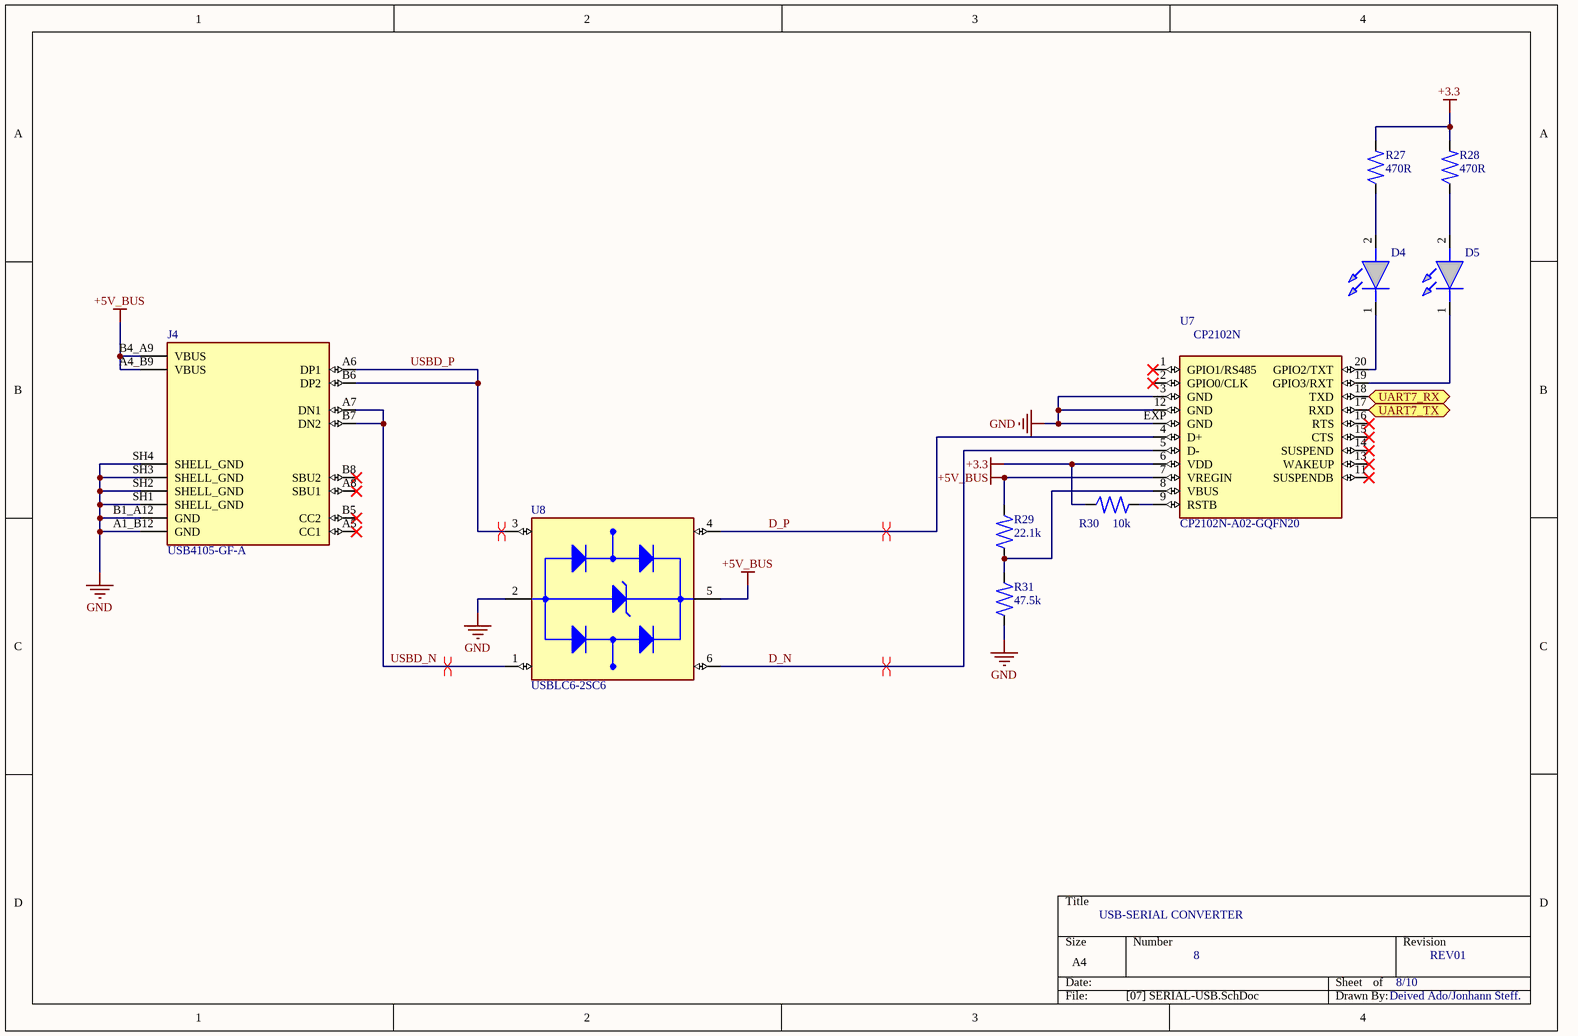
[diagram p6: [07] SERIAL-USB.SchDoc]

### Parts
D4  LED GREEN SMD  [LED 0805]  (value not drawn)
D5  LED GREEN SMD  [LED 0805]  (value not drawn)
J4  USB4105-GF-A  [GCT_USB4105-GF-A]
R27  470R  [RES_0603]
R28  470R  [RES_0603]
R29  22.1k  [RES_0603]
R30  10k  [RES_0603]
R31  47.5k  [RES_0603]
U7  CP2102N-A02-GQFN20  [WFQFN-20]
U8  USBLC6-2SC6  [SOT95P280X145-6N]

### Ports
UART7_RX (out), UART7_TX (in)

### Nets
+3.3: R27.1 R28.1 R30.2 U7.6(VDD)
+5V_BUS: J4.A4_B9(VBUS) J4.B4_A9(VBUS) R29.2 U7.7(VREGIN) U8.5(VBUS)
GND: J4.A1_B12(GND) J4.B1_A12(GND) J4.SH1(SHELL_GND) J4.SH2(SHELL_GND) J4.SH3(SHELL_GND) J4.SH4(SHELL_GND) R31.1 U7.3(GND) U7.12(GND) U7.EXP(GND) U8.2(GND)
D_N: U7.5(D-) U8.6(I/O1_OUT)
D_P: U7.4(D+) U8.4(I/O2_OUT)
USBD_N: J4.A7(DN1) J4.B7(DN2) U8.1(I/O1_IN)
USBD_P: J4.A6(DP1) J4.B6(DP2) U8.3(I/O2_IN)
NetD4_1: D4.1(K) U7.20(GPIO2/TXT)
NetD4_2: D4.2(A) R27.2
NetD5_1: D5.1(K) U7.19(GPIO3/RXT)
NetD5_2: D5.2(A) R28.2
NetR29_1: R29.1 R31.2 U7.8(VBUS)
NetR30_1: R30.1 U7.9(RSTB)
NetU1_20: U7.18(TXD) ; port UART7_RX
NetU1_21: U7.17(RXD) ; port UART7_TX

Not connected (* = marked no-connect by the designer): J4 A5(CC1)* A8(SBU1)* B5(CC2)* B8(SBU2)*; U7 1(GPIO1/RS485)* 2(GPIO0/CLK)* 11(SUSPENDB)* 13(WAKEUP)* 14(SUSPEND)* 15(CTS)* 16(RTS)*

### Layout directives
differential pair: D_N, D_P, USBD_N, USBD_P

### Notes on the sheet
- USB-SERIAL CONVERTER
- 8
- 8/10
- REV01
- Deived Ado/Jonhann Steff.
- (in symbol CP2102N-A02-GQFN20) CP2102N

### Library data of the parts
D4 D5 = LED GREEN SMD: as D6 on sheet [03] POWER; Purchase-URL: https://br.mouser.com/ProductDetail/Wurth-Elektronik/150080GS75000?qs=2kOmHSv6VfQRoTEZVk1mGA%3D%3D; Datasheet: https://www.we-online.com/components/products/datasheet/150080GS75000.pdf; Price: 0,19
J4 = USB4105-GF-A: USB-C (USB TYPE-C) USB 2.0 Receptacle Connector 24 (16+8 Dummy) Position Surface Mount, Right Angle; Through Hole; MF: GCT; SnapEDA_Link: https://www.snapeda.com/parts/USB4105-GF-A/Global+Connector+Technology/view-part/?ref=snap; Package: None; Value: *; MP: USB4105-GF-A; Check_prices: https://www.snapeda.com/parts/USB4105-GF-A/Global+Connector+Technology/view-part/?ref=eda
R27-R31 = R_Small: Generic Resistor symbol
U7 = CP2102N-A02-GQFN20: USB Bridge, USB to UART USB 2.0 UART Interface 20-QFN (3x3); MF: Silicon Labs; Availability: In Stock; Price: None; Purchase-URL: https://pricing.snapeda.com/search/part/CP2102N-A02-GQFN20/?ref=eda; Package: WFQFN-20 Silicon Labs; SnapEDA_Link: https://www.snapeda.com/parts/CP2102N-A02-GQFN20/Silicon+Labs/view-part/?ref=snap; MP: CP2102N-A02-GQFN20; Value: *; Check_prices: https://www.snapeda.com/parts/CP2102N-A02-GQFN20/Silicon+Labs/view-part/?ref=eda
U8 = USBLC6-2SC6: as U3 on sheet [04] ETHERNET; Value: *; SnapEDA_Link: https://www.snapeda.com/parts/USBLC6-2SC6/STMicroelectronics/view-part/?ref=snap; Check_prices: https://www.snapeda.com/parts/USBLC6-2SC6/STMicroelectronics/view-part/?ref=eda; Purchase-URL: https://pricing.snapeda.com/search/part/USBLC6-2SC6/?ref=eda; Price: None; Availability: In Stock; Package: SOT-23-6 STMicroelectronics; MP: USBLC6-2SC6

## Sheet [08] MISC.SchDoc
size A4
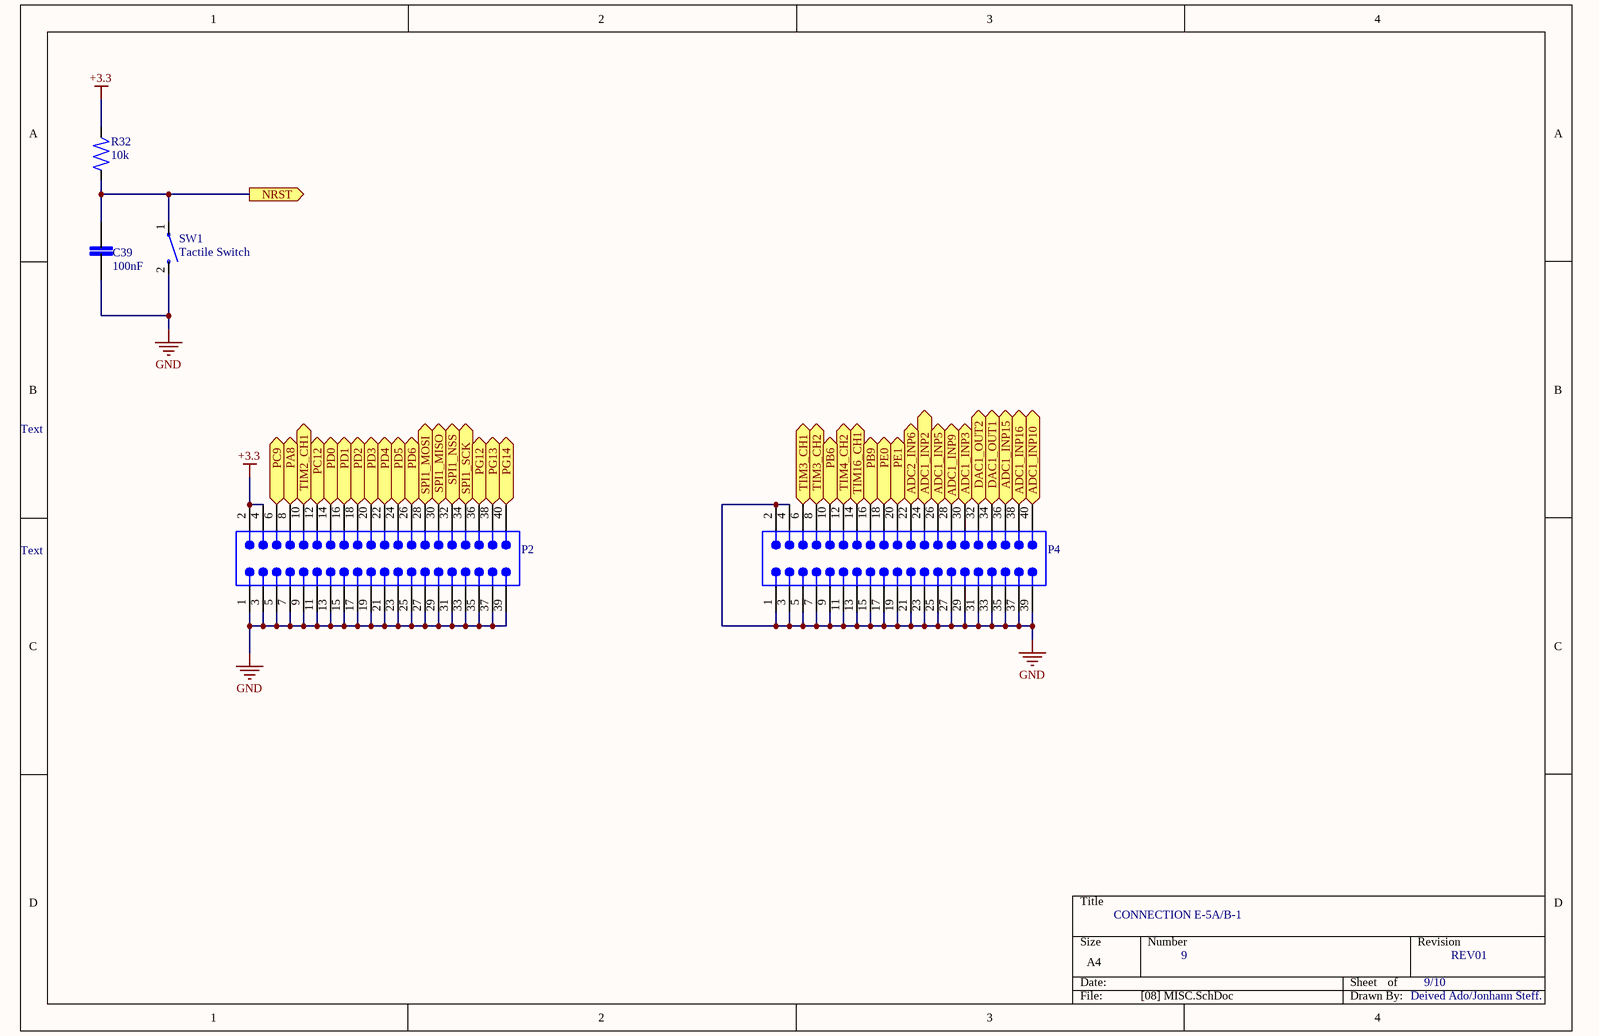
[diagram p7: [08] MISC.SchDoc]

### Parts
C39  100nF  [CAP_0603]
P2  62504021621  [62504021621]  (value not drawn)
P4  62504021621  [62504021621]  (value not drawn)
R32  10k  [RES_0603]
SW1  Tactile Switch  [SW_1437566-3]

### Ports
ADC1_INP2, ADC1_INP3, ADC1_INP5, ADC1_INP9 (out), ADC1_INP10 (out), ADC1_INP15, ADC1_INP16, ADC2_INP6 (out), DAC1_OUT1 (in), DAC1_OUT2 (in), NRST (out), PA8 (bidir), PB6 (bidir), PB9 (bidir), PC9 (bidir), PC12 (bidir), PD0 (bidir), PD1 (bidir), PD2 (bidir), PD3 (bidir), PD4 (bidir), PD5 (bidir), PD6 (bidir), PE0 (bidir), PE1 (bidir), PG12 (bidir), PG13 (bidir), PG14 (bidir), SPI1_MISO (out), SPI1_MOSI (in), SPI1_NSS (in), SPI1_SCK (in), TIM2_CH1 (in), TIM3_CH1 (in), TIM3_CH2 (in), TIM4_CH2 (in), TIM16_CH1 (in)

### Nets
+3.3: P2.2 P2.4 R32.2
GND: C39.1 P2.1 P2.3 P2.5 P2.7 P2.9 P2.11 P2.13 P2.15 P2.17 P2.19 P2.21 P2.23 P2.25 P2.27 P2.29 P2.31 P2.33 P2.35 P2.37 P2.39 P4.1 P4.2 P4.3 P4.4 P4.5 P4.7 P4.9 P4.11 P4.13 P4.15 P4.17 P4.19 P4.21 P4.23 P4.25 P4.27 P4.29 P4.31 P4.33 P4.35 P4.37 P4.39 SW1.2
NRST: C39.2 R32.1 SW1.1 ; port NRST
NetP2_6: P2.6 ; port PC9
NetP2_8: P2.8 ; port PA8
NetP2_10: P2.10 ; port TIM2_CH1
NetP2_12: P2.12 ; port PC12
NetP2_14: P2.14 ; port PD0
NetP2_16: P2.16 ; port PD1
NetP2_18: P2.18 ; port PD2
NetP2_20: P2.20 ; port PD3
NetP2_22: P2.22 ; port PD4
NetP2_24: P2.24 ; port PD5
NetP2_26: P2.26 ; port PD6
NetP2_28: P2.28 ; port SPI1_MOSI
NetP2_30: P2.30 ; port SPI1_MISO
NetP2_32: P2.32 ; port SPI1_NSS
NetP2_34: P2.34 ; port SPI1_SCK
NetP2_36: P2.36 ; port PG12
NetP2_38: P2.38 ; port PG13
NetP2_40: P2.40 ; port PG14
NetP4_6: P4.6 ; port TIM3_CH1
NetP4_8: P4.8 ; port TIM3_CH2
NetP4_10: P4.10 ; port PB6
NetP4_12: P4.12 ; port TIM4_CH2
NetP4_14: P4.14 ; port TIM16_CH1
NetP4_16: P4.16 ; port PB9
NetP4_18: P4.18 ; port PE0
NetP4_20: P4.20 ; port PE1
NetP4_22: P4.22 ; port ADC2_INP6
NetP4_24: P4.24 ; port ADC1_INP2
NetP4_26: P4.26 ; port ADC1_INP5
NetP4_28: P4.28 ; port ADC1_INP9
NetP4_30: P4.30 ; port ADC1_INP3
NetP4_32: P4.32 ; port DAC1_OUT2
NetP4_34: P4.34 ; port DAC1_OUT1
NetP4_36: P4.36 ; port ADC1_INP15
NetP4_38: P4.38 ; port ADC1_INP16
NetP4_40: P4.40 ; port ADC1_INP10

### Notes on the sheet
- Text
- CONNECTION E-5A/B-1
- 9
- 9/10
- REV01
- Deived Ado/Jonhann Steff.

### Library data of the parts
C39 = C_Small: Generic capacitor symbol
P2 P4 = 62504021621: WR-BHD Male Box Header, THT Straight, pitch 2mm, 2 row, 40 pin; Manufacturer: Wurth Elektronik; Contact Resistance: 20mOhm; Insulation Resistance: 1000MOhm; Rated Current: 2A; Working Voltage: 250V; Withstanding Voltage: 500V; Manufacturer Part Number: 62504021621; Category: Wire-to-Board Connectors; Match Code: WR-BHD; ComponentLink1Description: Website Link; ComponentLink1URL: https://www.we-online.com/redexpert/article/62504021621?ad; ComponentLink2Description: Datasheet Link; ComponentLink2URL: https://www.we-online.com/redexpert/spec/62504021621?ad; Mount: Through Hole; Operating Temperature Max: 125°C; Operating Temperature Min: -40°C; Packaging: Tray; Length: 47.2mm; Width: 5.5mm; Height: 5.6mm; Gender: Male; Number of Pins: 40; Number of Rows: 2; Orientation: Straight; Pitch: 2mm
R32 = R_Small: Generic Resistor symbol
SW1 = Tactile Switch: Switch Tactile OFF (ON) SPST Rectangular Button Gull Wing 0.05A 12VDC SMD Loose Piece; Manufacturer: TE Connectivity / Alcoswitch; Mfr. Part #: FSMSM; Price: 0,33; Purchase-URL: https://br.mouser.com/ProductDetail/TE-Connectivity-Alcoswitch/FSMSM?qs=UhRTNahLC3yPLf3YjzjKAA%3D%3D; Datasheet: https://br.mouser.com/datasheet/2/418/NG_CD_1437566-3_C2_1437566_3_1_c.dwg-116271.pdf

## Sheet [09] USB-DFU.SchDoc
size A4; SheetNumber: 9
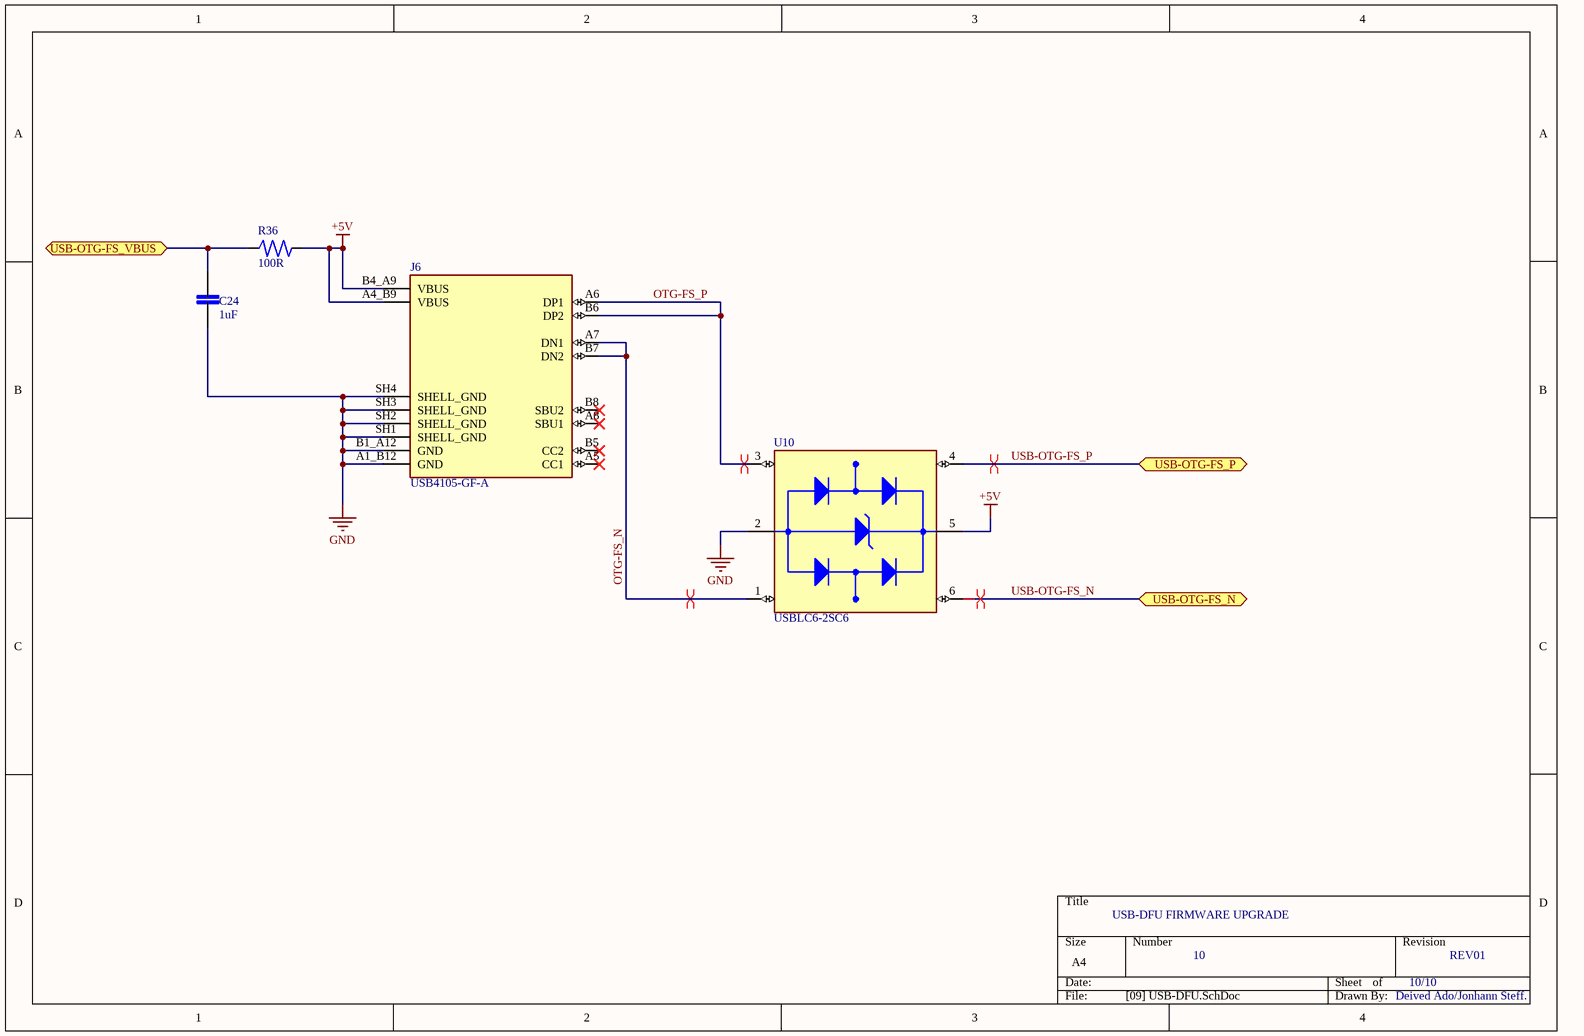
[diagram p8: [09] USB-DFU.SchDoc]

### Parts
C24  1uF  [CAP_0603]
J6  USB4105-GF-A  [GCT_USB4105-GF-A]
R36  100R  [RES_0603]
U10  USBLC6-2SC6  [SOT95P280X145-6N]

### Ports
USB-OTG-FS_N (bidir), USB-OTG-FS_P (bidir), USB-OTG-FS_VBUS

### Nets
+5V: J6.A4_B9(VBUS) J6.B4_A9(VBUS) R36.1 U10.5(VBUS)
GND: C24.1 J6.A1_B12(GND) J6.B1_A12(GND) J6.SH1(SHELL_GND) J6.SH2(SHELL_GND) J6.SH3(SHELL_GND) J6.SH4(SHELL_GND) U10.2(GND)
OTG-FS_N: J6.A7(DN1) J6.B7(DN2) U10.1(I/O1_IN)
OTG-FS_P: J6.A6(DP1) J6.B6(DP2) U10.3(I/O2_IN)
USB-OTG-FS_N: U10.6(I/O1_OUT) ; port USB-OTG-FS_N
USB-OTG-FS_P: U10.4(I/O2_OUT) ; port USB-OTG-FS_P
NetC24_2: C24.2 R36.2 ; port USB-OTG-FS_VBUS

Not connected (* = marked no-connect by the designer): J6 A5(CC1)* A8(SBU1)* B5(CC2)* B8(SBU2)*

### Layout directives
differential pair: OTG-FS_N, OTG-FS_P, USB-OTG-FS_N, USB-OTG-FS_P

### Notes on the sheet
- USB-DFU FIRMWARE UPGRADE
- 10
- 10/10
- REV01
- Deived Ado/Jonhann Steff.

### Library data of the parts
C24 = C_Small: Generic capacitor symbol
J6 = USB4105-GF-A: as J4 on sheet [07] SERIAL-USB; SnapEDA_Link: https://www.snapeda.com/parts/USB4105-GF-A/Global+Connector+Technology/view-part/?ref=snap; Package: None; Value: *; MP: USB4105-GF-A; Check_prices: https://www.snapeda.com/parts/USB4105-GF-A/Global+Connector+Technology/view-part/?ref=eda
R36 = R_Small: Generic Resistor symbol
U10 = USBLC6-2SC6: as U3 on sheet [04] ETHERNET; Value: *; SnapEDA_Link: https://www.snapeda.com/parts/USBLC6-2SC6/STMicroelectronics/view-part/?ref=snap; Check_prices: https://www.snapeda.com/parts/USBLC6-2SC6/STMicroelectronics/view-part/?ref=eda; Purchase-URL: https://pricing.snapeda.com/search/part/USBLC6-2SC6/?ref=eda; Price: None; Availability: In Stock; Package: SOT-23-6 STMicroelectronics; MP: USBLC6-2SC6

## Nets that join several sheets
+3.3: [02] MCU (23 pins), [03] POWER (20 pins), [04] ETHERNET (7 pins), [07] SERIAL-USB (R27.1 R28.1 R30.2 U7.6), [08] MISC (P2.2 P2.4 R32.2)
+5V: [03] POWER (J5.1 U9.3), [05] RS485 (C38.2 U6.8), [09] USB-DFU (J6.A4_B9 J6.B4_A9 R36.1 U10.5)
GND: [02] MCU (31 pins), [03] POWER (22 pins), [04] ETHERNET (23 pins), [05] RS485 (C38.1 J2.3 J3.3 U6.5), [07] SERIAL-USB (11 pins), [08] MISC (44 pins), [09] USB-DFU (8 pins)
NetC24_2: [02] MCU (U1.98), [09] USB-DFU (C24.2 R36.2)
NetP2_6: [02] MCU (U1.96), [08] MISC (P2.6)
NetP2_8: [02] MCU (U1.97), [08] MISC (P2.8)
NetP2_10: [02] MCU (U1.108), [08] MISC (P2.10)
NetP2_12: [02] MCU (U1.111), [08] MISC (P2.12)
NetP2_14: [02] MCU (U1.112), [08] MISC (P2.14)
NetP2_16: [02] MCU (U1.113), [08] MISC (P2.16)
NetP2_18: [02] MCU (U1.114), [08] MISC (P2.18)
NetP2_20: [02] MCU (U1.115), [08] MISC (P2.20)
NetP2_22: [02] MCU (U1.116), [08] MISC (P2.22)
NetP2_24: [02] MCU (U1.117), [08] MISC (P2.24)
NetP2_26: [02] MCU (U1.120), [08] MISC (P2.26)
NetP2_28: [02] MCU (U1.121), [08] MISC (P2.28)
NetP2_30: [02] MCU (U1.122), [08] MISC (P2.30)
NetP2_32: [02] MCU (U1.123), [08] MISC (P2.32)
NetP2_34: [02] MCU (U1.124), [08] MISC (P2.34)
NetP2_36: [02] MCU (U1.125), [08] MISC (P2.36)
NetP2_38: [02] MCU (U1.126), [08] MISC (P2.38)
NetP2_40: [02] MCU (U1.127), [08] MISC (P2.40)
NetP4_6: [02] MCU (U1.131), [08] MISC (P4.6)
NetP4_8: [02] MCU (U1.132), [08] MISC (P4.8)
NetP4_10: [02] MCU (U1.133), [08] MISC (P4.10)
NetP4_12: [02] MCU (U1.134), [08] MISC (P4.12)
NetP4_14: [02] MCU (U1.136), [08] MISC (P4.14)
NetP4_16: [02] MCU (U1.137), [08] MISC (P4.16)
NetP4_18: [02] MCU (U1.138), [08] MISC (P4.18)
NetP4_20: [02] MCU (U1.139), [08] MISC (P4.20)
NetP4_22: [02] MCU (U1.53), [08] MISC (P4.22)
NetP4_24: [02] MCU (U1.52), [08] MISC (P4.24)
NetP4_26: [02] MCU (U1.50), [08] MISC (P4.26)
NetP4_28: [02] MCU (U1.49), [08] MISC (P4.28)
NetP4_30: [02] MCU (U1.45), [08] MISC (P4.30)
NetP4_32: [02] MCU (U1.44), [08] MISC (P4.32)
NetP4_34: [02] MCU (U1.43), [08] MISC (P4.34)
NetP4_36: [02] MCU (U1.40), [08] MISC (P4.36)
NetP4_38: [02] MCU (U1.37), [08] MISC (P4.38)
NetP4_40: [02] MCU (U1.28), [08] MISC (P4.40)
NetR12_2: [02] MCU (U1.39), [04] ETHERNET (R12.2 U5.12)
NetR20_1: [02] MCU (U1.38), [04] ETHERNET (R20.1)
NetR22_2: [02] MCU (U1.47), [04] ETHERNET (R22.2)
NetR23_2: [02] MCU (U1.48), [04] ETHERNET (R23.2)
NetR24_2: [02] MCU (U1.46), [04] ETHERNET (R24.2)
NetU1_20: [02] MCU (U1.20), [07] SERIAL-USB (U7.18)
NetU1_21: [02] MCU (U1.21), [07] SERIAL-USB (U7.17)
NetU1_29: [02] MCU (U1.29), [04] ETHERNET (U5.13)
NetU1_67: [02] MCU (U1.67), [04] ETHERNET (U5.16)
NetU1_72: [02] MCU (U1.72), [04] ETHERNET (U5.17)
NetU1_73: [02] MCU (U1.73), [04] ETHERNET (U5.18)
NetU1_74: [02] MCU (U1.74), [05] RS485 (U6.2 U6.3)
NetU1_109: [02] MCU (U1.109), [05] RS485 (U6.4)
NetU1_110: [02] MCU (U1.110), [05] RS485 (U6.1)
NRST: [02] MCU (R5.2 U1.27), [04] ETHERNET (U5.15), [08] MISC (C39.2 R32.1 SW1.1)
USB-OTG-FS_N: [02] MCU (U1.100), [09] USB-DFU (U10.6)
USB-OTG-FS_P: [02] MCU (U1.101), [09] USB-DFU (U10.4)